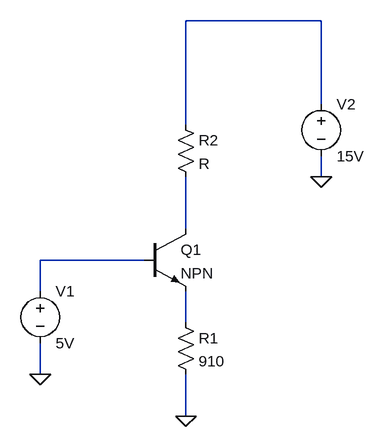
[diagram p0: schematic Draft1.asc]
Draft1.asc, the LTspice schematic file:
Version 4
SHEET 1 880 680
WIRE 480 -240 272 -240
WIRE 480 -112 480 -240
WIRE 272 -80 272 -240
WIRE 480 0 480 -32
WIRE 272 80 272 0
WIRE 208 128 48 128
WIRE 48 176 48 128
WIRE 272 224 272 176
WIRE 48 304 48 256
WIRE 272 368 272 304
FLAG 272 368 0
FLAG 48 304 0
FLAG 480 0 0
SYMBOL npn 208 80 R0
SYMATTR InstName Q1
SYMBOL voltage 48 160 R0
WINDOW 123 0 0 Left 0
WINDOW 39 0 0 Left 0
SYMATTR InstName V1
SYMATTR Value 5V
SYMBOL voltage 480 -128 R0
WINDOW 123 0 0 Left 0
WINDOW 39 0 0 Left 0
SYMATTR InstName V2
SYMATTR Value 15V
SYMBOL res 256 208 R0
SYMATTR InstName R1
SYMATTR Value 910
SYMATTR SpiceLine tol=5
SYMBOL res 256 -96 R0
SYMATTR InstName R2

The netlist it stands for:
* Draft1.asc
Q1 N002 N003 N004 0 NPN
V1 N003 0 5V
V2 N001 0 15V
R1 N004 0 910 tol=5
R2 N001 N002 R
.model NPN NPN
.model PNP PNP
.lib standard.bjt
.backanno
.end